# EAGLE design micro3 (EAGLE 7.6.0)
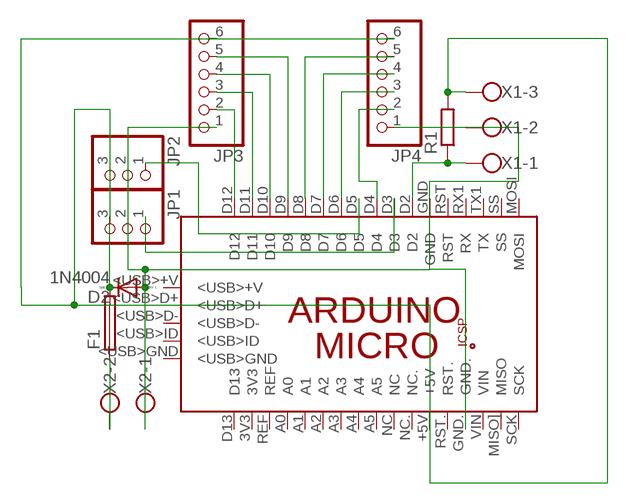
[diagram p0: schematic, sheet 1]

## Parts
D2  1N4004  [DO41-10]
F1  GSH15  [GSH15]
JP1  PINHD-1X3  [1X03]
JP2  PINHD-1X3  [1X03]
JP3  PINHD-1X6  [1X06]
JP4  PINHD-1X6  [1X06]
PCB1  ARDUINO_MICRO  [ARDUINO_MICRO]
R1  R-EU_0207/15  [0207/15]
X1  W237-103  [W237-103]
X2  W237-102  [W237-102]

## Nets
N$1: JP3.2 PCB1.D12
N$2: JP3.3 PCB1.D11
N$3: JP3.4 PCB1.D10
N$4: JP3.5 PCB1.D9
N$6: JP4.5 PCB1.D8
N$7: JP4.4 PCB1.D7
N$8: JP4.3 PCB1.D6
N$9: JP4.2 PCB1.D4
N$10: JP2.1 PCB1.D5
N$11: PCB1.D2 R1.1 X1.1
N$12: JP1.1 PCB1.D3
N$13: D2.C F1.2 JP1.3 JP2.3 JP3.6 JP4.6 PCB1.+5V R1.2 X1.3
N$14: F1.1 X2.2
N$15: D2.A JP1.2 JP2.2 JP3.1 JP4.1 PCB1.GND PCB1.GND. X1.2 X2.1
Unconnected: PCB1.3V3 PCB1.5V PCB1.<USB>+V PCB1.<USB>D+ PCB1.<USB>D- PCB1.<USB>GND PCB1.<USB>ID PCB1.A0 PCB1.A1 PCB1.A2 PCB1.A3 PCB1.A4 PCB1.A5 PCB1.D13 PCB1.GND_ PCB1.MISO. PCB1.MISO](MISO) PCB1.MOSI PCB1.MOSI. PCB1.NC PCB1.NC. PCB1.REF PCB1.RESET.. PCB1.RST PCB1.RST. PCB1.RX1(RX) PCB1.SCK PCB1.SCK. PCB1.SS PCB1.TX1(TX) PCB1.VIN

## Library data of the parts
D2 = diode:1N4004: DIODE general purpose rectifier, 1 A
F1 = fuse:GSH15: FUSE HOLDER grid 15mm, 19649 Wickmann; MPN: 64900001039; OC_FARNELL: 1271673; OC_NEWARK: 02P0318
JP1 JP2 = pinhead:PINHD-1X3: PIN HEADER
JP3 JP4 = pinhead:PINHD-1X6: PIN HEADER
PCB1 = E14_Arduino_revB:ARDUINO_MICRO: Device for representing an Arduino Micro board with a footprint in an EAGLE design. Created by Dave Young for Element14. More EAGLE documentation at: http://www.element14.com/community/community/knode/cadsoft_eagle
R1 = resistor:R-EU_: RESISTOR, European symbol
X1 = con-wago-500:W237-103: WAGO SCREW CLAMP; MPN: 237-103; OC_FARNELL: unknown; OC_NEWARK: 18M7116
X2 = con-wago-500:W237-102: WAGO SCREW CLAMP; MPN: 237-102; OC_FARNELL: unknown; OC_NEWARK: 70K9898

## Board
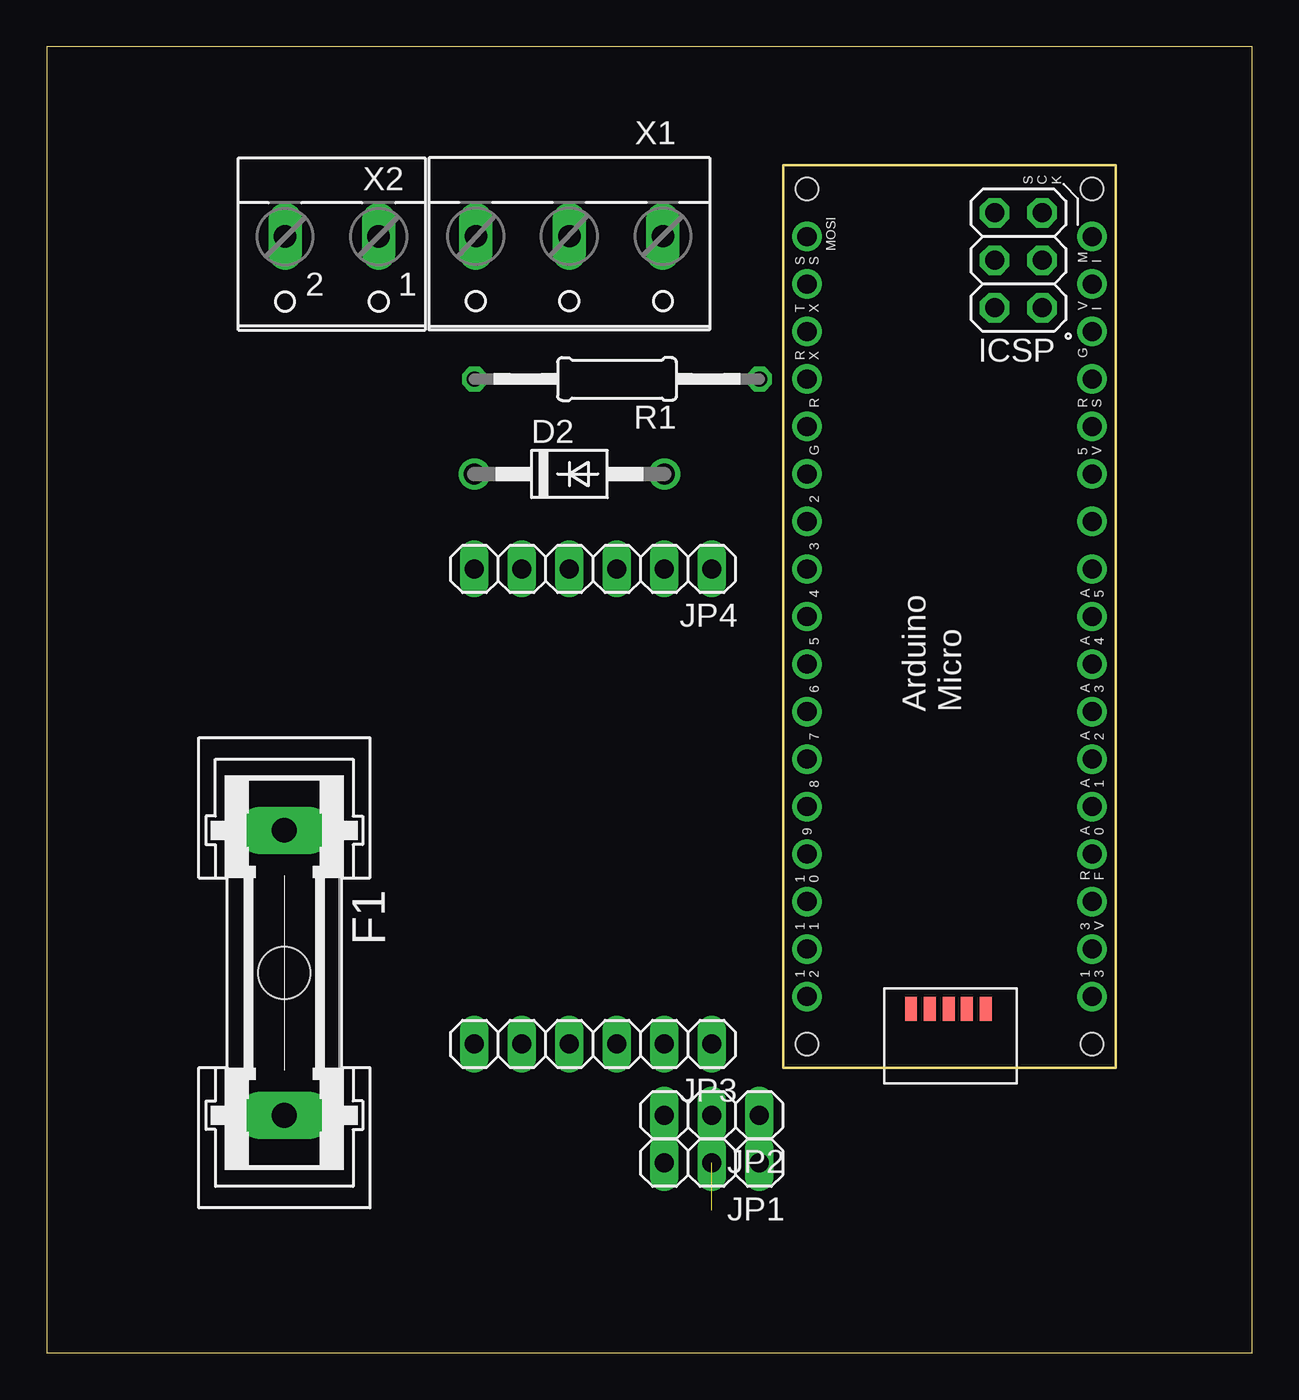
[diagram p1: board, top side]
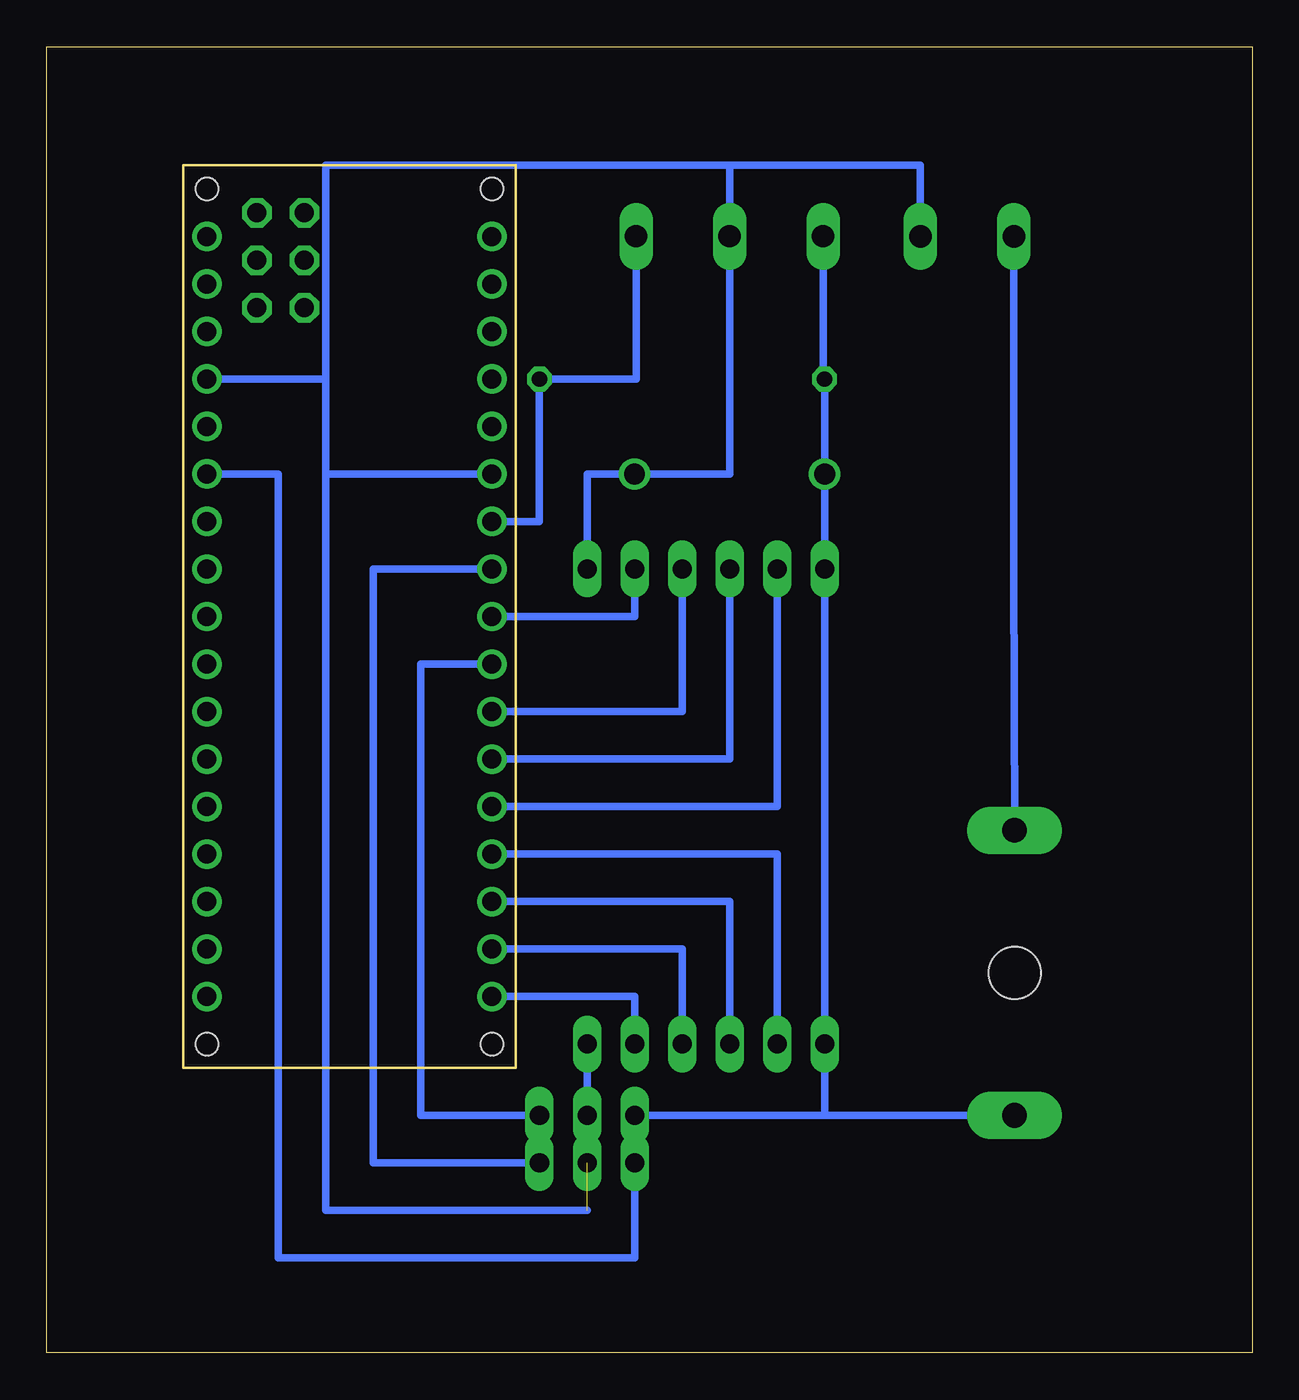
[diagram p2: board, bottom side, seen from below]

Size 64.44 x 69.84 mm. Coordinates in mm from the lower left corner, seen from the top.
Outline: 0,0 64.44,0 64.44,69.84 0,69.84 0,0
Copper layers (1*16): Top 0.035mm / dielectric 1.5mm / Bottom 0.035mm
Design rules "default": minimum track width 10mil, minimum drill 24mil, track to track 8mil, track to pad 8mil, pad to pad 8mil, via to via 8mil, smd to smd 8mil, copper to edge 40mil, drill to drill 8mil, minimum pad ring 10mil, minimum via ring 8mil, stop-mask expansion 4mil, vias tented up to drill 0mil, thermal gap 10mil

### Footprints (pad centres in the part's own frame; a part is rotated, then mirrored left to right if it is on the bottom)
DO41-10 = drill 1.118: A 5.08,0; C -5.08,0
GSH15 = drill 1.321 pad 2.54 long: 1 -7.62,0; 2 7.62,0 | hole 2.794: 0,0
1X03 = drill 1.016 long: 1 -2.54,0; 2 0,0; 3 2.54,0
1X06 = drill 1.016 long: 1 -6.35,0; 2 -3.81,0; 3 -1.27,0; 4 1.27,0; 5 3.81,0; 6 6.35,0
ARDUINO_MICRO = drill 1.016 pad 1.575: 3V3 6.35,1.27; +5V 31.75,1.27; A0 11.43,1.27; A1 13.97,1.27; A2 16.51,1.27; A3 19.05,1.27; A4 21.59,1.27; A5 24.13,1.27; D2 29.21,16.51; D3 26.67,16.51; D4 24.13,16.51; D5 21.59,16.51; D6 19.05,16.51; D7 16.51,16.51; D8 13.97,16.51; D9 11.43,16.51; D10 8.89,16.51; D11 6.35,16.51; D12 3.81,16.51; D13 3.81,1.27; GND 31.75,16.51; GND. 36.83,1.27; MISO] 41.91,1.27; MOSI 44.45,16.51; NC 26.67,1.27; NC. 29.21,1.27; REF 8.89,1.27; RST 34.29,16.51; RST. 34.29,1.27; RX1 36.83,16.51; SCK 44.45,1.27; SS 41.91,16.51; TX1 39.37,16.51; VIN 39.37,1.27 | drill 1.016 pad 1.575 octagon: 5V 40.64,6.477; GND_ 45.72,6.477; MISO. 40.64,3.937; MOSI. 43.18,6.477; RESET.. 45.72,3.937; SCK. 43.18,3.937 | smd 1.27 x 0.635: <USB>+V 3.15,10.947; <USB>D+ 3.15,9.957; <USB>D- 3.15,8.941; <USB>GND 3.15,6.96; <USB>ID 3.15,7.976 | hole 1.2: 1.27,1.27; 1.27,16.51; 46.99,16.51; 46.99,1.27
0207/15 = drill 0.813 octagon: 1 -7.62,0; 2 7.62,0
W237-103 = drill 1.194 long: 1 -5,-1.29; 2 0,-1.29; 3 5,-1.29
W237-102 = drill 1.194 long: 1 -2.5,-1.27; 2 2.5,-1.27

### Placement (x,y rotation side)
D2  27.94,46.99 0 top
F1  12.7,20.32 270 top
JP1  35.56,10.16 180 top
JP2  35.56,12.7 180 top
JP3  29.21,16.51 180 top
JP4  29.21,41.91 180 top
PCB1  57.15,15.24 90 top
R1  30.48,52.07 180 top
X1  27.94,58.42 180 top
X2  15.24,58.42 180 top

### Tracks (layer width: path | path; a pad name or v marks a point on that pad's centre or on a via)
N$1
  Bottom 0.406: PCB1.D12 33.02,19.05 JP3.2
N$2
  Bottom 0.406: PCB1.D11 30.48,21.59 JP3.3
N$3
  Bottom 0.406: PCB1.D10 27.94,24.13 JP3.4
N$4
  Bottom 0.406: JP3.5 25.4,26.67 PCB1.D9
N$6
  Bottom 0.406: JP4.5 25.4,29.21 PCB1.D8
N$7
  Bottom 0.406: JP4.4 27.94,31.75 PCB1.D7
N$8
  Bottom 0.406: JP4.3 30.48,34.29 PCB1.D6
N$9
  Bottom 0.406: JP4.2 33.02,39.37 PCB1.D4
N$10
  Bottom 0.406: JP2.1 44.45,12.7 44.45,36.83 PCB1.D5
N$11
  Bottom 0.406: X1.1 32.94,52.07 R1.1 38.1,44.45 PCB1.D2
N$12
  Bottom 0.406: JP1.1 46.99,10.16 46.99,41.91 PCB1.D3
N$13
  Bottom 0.406: PCB1.+5V 52.07,46.99 52.07,5.08 33.02,5.08 JP2.3 | JP1.3 JP2.3 | 22.86,12.7 JP2.3 | X1.3 22.94,52.07 R1.2 D2.C JP4.6 JP3.6 22.86,12.7 | F1.2 22.86,12.7
N$14
  Bottom 0.406: X2.2 12.74,41.91 F1.1
N$15  (1 unrouted)
  Bottom 0.406: JP3.1 JP2.2 JP1.2 | 49.53,46.99 49.53,7.62 35.56,7.62 | PCB1.GND 49.53,46.99 | 49.53,46.99 49.53,52.07 | 49.53,52.07 49.53,63.5 27.94,63.5 | 27.94,63.5 X1.2 27.94,46.99 D2.A 35.56,46.99 JP4.1 | PCB1.GND. 49.53,52.07 | 27.94,63.5 17.74,63.5 X2.1